# Altium schematic sheet Human_Body_Detection_backup.SchDoc: Human_Body_Detection_Interface
size A4
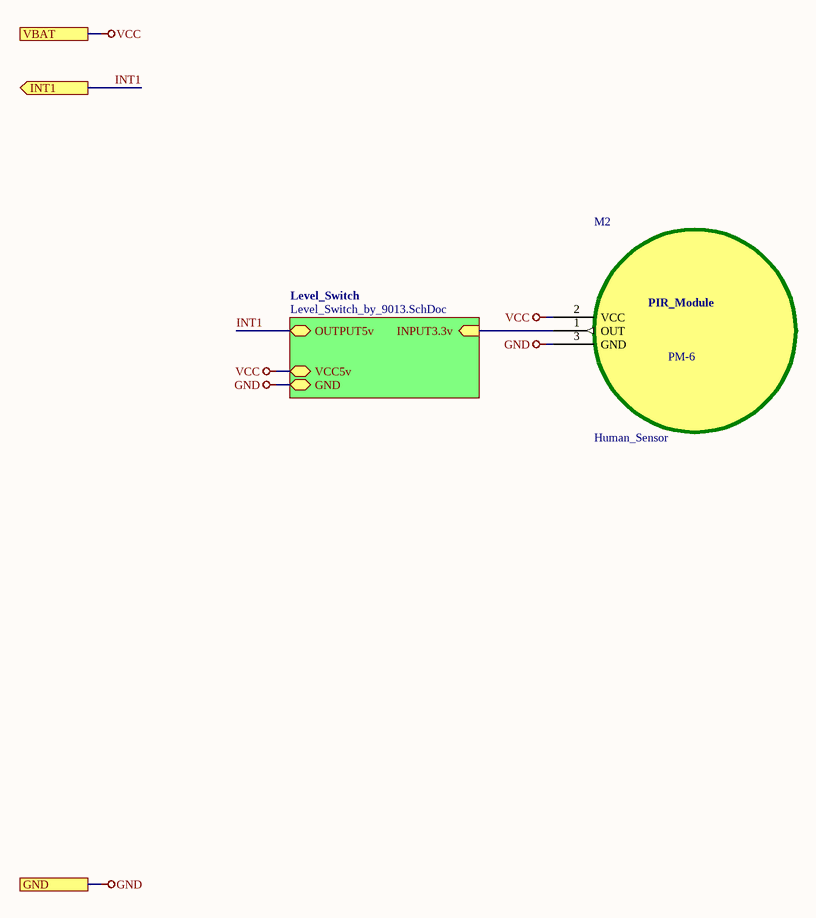
[diagram p0: Human_Body_Detection_backup.SchDoc]

## Parts
M2  Human_Sensor  [PM-6]

## Sub-sheets
Level_Switch = Level_Switch_by_9013.SchDoc: VCC5v, GND, OUTPUT5v, INPUT3.3v (in)

## Ports
GND, INT1 (out), VBAT

## Nets
GND: M2.3(GND) ; port GND, sheet Level_Switch/GND
VCC: M2.2(VCC) ; port VBAT, sheet Level_Switch/VCC5v
INT1: port INT1, sheet Level_Switch/OUTPUT5v
NetM2_1: M2.1(OUT) ; sheet Level_Switch/INPUT3.3v

## Notes on the sheet
- (in symbol Human_Sensor) PIR_Module; PM-6